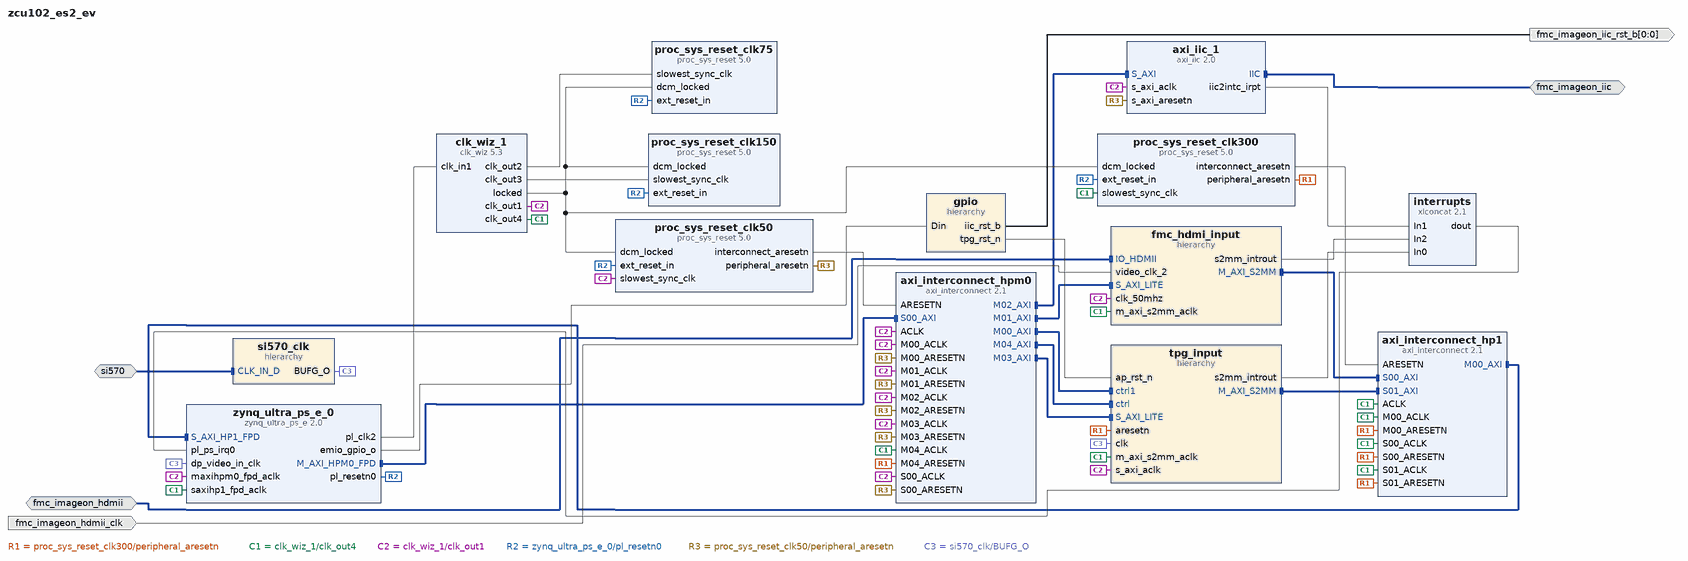
[diagram p0: block diagram of the top level]
# Vivado block design zcu102_es2_ev, xczu9eg-ffvb1156-2L-e-es2, Vivado 2016.3_sdx
create_bd_design zcu102_es2_ev

create_bd_intf_port -mode Slave -vlnv avnet.com:interface:avnet_hdmi_rtl:1.0 fmc_imageon_hdmii
create_bd_intf_port -mode Master -vlnv xilinx.com:interface:iic_rtl:1.0 fmc_imageon_iic
create_bd_intf_port -mode Slave -vlnv xilinx.com:interface:diff_clock_rtl:1.0 si570
create_bd_port -dir I -type clk fmc_imageon_hdmii_clk
set_property -dict {CONFIG.FREQ_HZ 148500000} [get_bd_ports fmc_imageon_hdmii_clk]
create_bd_port -dir O -from 0 -to 0 fmc_imageon_iic_rst_b

create_bd_cell -type ip -vlnv xilinx.com:ip:axi_iic:2.0 axi_iic_1
create_bd_cell -type ip -vlnv xilinx.com:ip:axi_interconnect:2.1 axi_interconnect_hp1
set_property -dict [list \
  CONFIG.NUM_SI 2 \
  CONFIG.NUM_MI 1 \
  CONFIG.STRATEGY 2 \
  CONFIG.ENABLE_ADVANCED_OPTIONS 0 \
  CONFIG.M00_HAS_REGSLICE 1 \
  CONFIG.M00_HAS_DATA_FIFO 2 \
  CONFIG.S00_HAS_REGSLICE 1 \
  CONFIG.S01_HAS_REGSLICE 1 \
  CONFIG.S00_HAS_DATA_FIFO 2 \
  CONFIG.S01_HAS_DATA_FIFO 2 \
  CONFIG.S02_HAS_DATA_FIFO 2 \
] [get_bd_cells axi_interconnect_hp1]
create_bd_cell -type ip -vlnv xilinx.com:ip:axi_interconnect:2.1 axi_interconnect_hpm0
set_property -dict {CONFIG.NUM_MI 5} [get_bd_cells axi_interconnect_hpm0]
create_bd_cell -type ip -vlnv xilinx.com:ip:clk_wiz:5.3 clk_wiz_1
set_property -dict [list \
  CONFIG.PRIM_IN_FREQ 300.000 \
  CONFIG.PHASESHIFT_MODE LATENCY \
  CONFIG.USE_INCLK_SWITCHOVER false \
  CONFIG.CLKIN1_JITTER_PS 33.330000000000005 \
  CONFIG.CLKOUT2_USED true \
  CONFIG.CLKOUT3_USED true \
  CONFIG.CLKOUT4_USED true \
  CONFIG.NUM_OUT_CLKS 4 \
  CONFIG.CLKOUT1_REQUESTED_OUT_FREQ 50.000 \
  CONFIG.CLKOUT2_REQUESTED_OUT_FREQ 75.000 \
  CONFIG.CLKOUT3_REQUESTED_OUT_FREQ 150.000 \
  CONFIG.CLKOUT4_REQUESTED_OUT_FREQ 300.000 \
  CONFIG.PRIM_SOURCE No_buffer \
  CONFIG.CLKOUT1_DRIVES Buffer \
  CONFIG.CLKOUT2_DRIVES Buffer \
  CONFIG.CLKOUT3_DRIVES Buffer \
  CONFIG.CLKOUT4_DRIVES Buffer \
  CONFIG.CLKOUT5_DRIVES Buffer \
  CONFIG.CLKOUT6_DRIVES Buffer \
  CONFIG.CLKOUT7_DRIVES Buffer \
  CONFIG.USE_RESET false \
  CONFIG.MMCM_DIVCLK_DIVIDE 1 \
  CONFIG.MMCM_CLKFBOUT_MULT_F 4.000 \
  CONFIG.MMCM_CLKIN1_PERIOD 3.333 \
  CONFIG.MMCM_CLKIN2_PERIOD 10.0 \
  CONFIG.MMCM_CLKOUT0_DIVIDE_F 24.000 \
  CONFIG.MMCM_CLKOUT1_DIVIDE 16 \
  CONFIG.MMCM_CLKOUT2_DIVIDE 8 \
  CONFIG.MMCM_CLKOUT3_DIVIDE 4 \
  CONFIG.CLKOUT1_JITTER 116.415 \
  CONFIG.CLKOUT1_PHASE_ERROR 77.836 \
  CONFIG.CLKOUT2_JITTER 107.379 \
  CONFIG.CLKOUT2_PHASE_ERROR 77.836 \
  CONFIG.CLKOUT3_JITTER 93.717 \
  CONFIG.CLKOUT3_PHASE_ERROR 77.836 \
  CONFIG.CLKOUT4_JITTER 81.814 \
  CONFIG.CLKOUT4_PHASE_ERROR 77.836 \
] [get_bd_cells clk_wiz_1]
create_bd_cell -type hier fmc_hdmi_input
create_bd_cell -type hier gpio
create_bd_cell -type ip -vlnv xilinx.com:ip:xlconcat:2.1 interrupts
set_property -dict {CONFIG.NUM_PORTS 3} [get_bd_cells interrupts]
create_bd_cell -type ip -vlnv xilinx.com:ip:proc_sys_reset:5.0 proc_sys_reset_clk50
set_property -dict {CONFIG.C_AUX_RESET_HIGH 0} [get_bd_cells proc_sys_reset_clk50]
create_bd_cell -type ip -vlnv xilinx.com:ip:proc_sys_reset:5.0 proc_sys_reset_clk75
set_property -dict {CONFIG.C_AUX_RESET_HIGH 0} [get_bd_cells proc_sys_reset_clk75]
create_bd_cell -type ip -vlnv xilinx.com:ip:proc_sys_reset:5.0 proc_sys_reset_clk150
set_property -dict {CONFIG.C_AUX_RESET_HIGH 0} [get_bd_cells proc_sys_reset_clk150]
create_bd_cell -type ip -vlnv xilinx.com:ip:proc_sys_reset:5.0 proc_sys_reset_clk300
set_property -dict {CONFIG.C_AUX_RESET_HIGH 0} [get_bd_cells proc_sys_reset_clk300]
create_bd_cell -type hier si570_clk
create_bd_cell -type hier tpg_input
create_bd_cell -type ip -vlnv xilinx.com:ip:zynq_ultra_ps_e:2.0 zynq_ultra_ps_e_0
set_property -dict [list \
  CONFIG.PSU__PSS_REF_CLK__FREQMHZ 33.333 \
  CONFIG.PSU__CAN1__PERIPHERAL__ENABLE 1 \
  CONFIG.PSU__CAN1__PERIPHERAL__IO {MIO 24 .. 25} \
  CONFIG.PSU__DPAUX__PERIPHERAL__ENABLE 1 \
  CONFIG.PSU__DPAUX__PERIPHERAL__IO {MIO 27 .. 30} \
  CONFIG.PSU__FPGA_PL0_ENABLE 1 \
  CONFIG.PSU__FPGA_PL1_ENABLE 1 \
  CONFIG.PSU__FPGA_PL2_ENABLE 1 \
  CONFIG.PSU__FPGA_PL3_ENABLE 1 \
  CONFIG.PSU__ENET3__PERIPHERAL__ENABLE 1 \
  CONFIG.PSU__ENET3__PERIPHERAL__IO {MIO 64 .. 75} \
  CONFIG.PSU__ENET3__GRP_MDIO__ENABLE 1 \
  CONFIG.PSU__ENET3__GRP_MDIO__IO {MIO 76 .. 77} \
  CONFIG.PSU__GPIO_EMIO__PERIPHERAL__ENABLE 1 \
  CONFIG.PSU__GPIO0_MIO__PERIPHERAL__ENABLE 1 \
  CONFIG.PSU__GPIO0_MIO__IO {MIO 0 .. 25} \
  CONFIG.PSU__GPIO1_MIO__PERIPHERAL__ENABLE 1 \
  CONFIG.PSU__GPIO1_MIO__IO {MIO 26 .. 51} \
  CONFIG.PSU__I2C0__PERIPHERAL__ENABLE 1 \
  CONFIG.PSU__I2C0__PERIPHERAL__IO {MIO 14 .. 15} \
  CONFIG.PSU__I2C1__PERIPHERAL__ENABLE 1 \
  CONFIG.PSU__I2C1__PERIPHERAL__IO {MIO 16 .. 17} \
  CONFIG.PSU__USB0__REF_CLK_SEL {Ref Clk2} \
  CONFIG.PSU__USB0__REF_CLK_FREQ 26 \
  CONFIG.PSU__DP__REF_CLK_SEL {Ref Clk3} \
  CONFIG.PSU__DP__REF_CLK_FREQ 27 \
  CONFIG.PSU__SATA__REF_CLK_SEL {Ref Clk1} \
  CONFIG.PSU__SATA__REF_CLK_FREQ 150 \
  CONFIG.PSU__DP__LANE_SEL {Dual Lower} \
  CONFIG.PSU__PMU__PERIPHERAL__ENABLE 1 \
  CONFIG.PSU__PMU__GPI0__ENABLE 1 \
  CONFIG.PSU__PMU__GPI1__ENABLE 0 \
  CONFIG.PSU__PMU__GPI2__ENABLE 0 \
  CONFIG.PSU__PMU__GPI3__ENABLE 0 \
  CONFIG.PSU__PMU__GPI4__ENABLE 0 \
  CONFIG.PSU__PMU__GPI5__ENABLE 0 \
  CONFIG.PSU__PMU__GPO0__ENABLE 1 \
  CONFIG.PSU__PMU__GPO1__ENABLE 1 \
  CONFIG.PSU__PMU__GPO2__ENABLE 1 \
  CONFIG.PSU__PMU__GPO3__ENABLE 1 \
  CONFIG.PSU__PMU__GPO4__ENABLE 1 \
  CONFIG.PSU__PMU__GPO5__ENABLE 1 \
  CONFIG.PSU__PMU__GPI0__IO {MIO 26} \
  CONFIG.PSU__PMU__GPO0__IO {MIO 32} \
  CONFIG.PSU__PMU__GPO1__IO {MIO 33} \
  CONFIG.PSU__PMU__GPO2__IO {MIO 34} \
  CONFIG.PSU__PMU__GPO3__IO {MIO 35} \
  CONFIG.PSU__PMU__GPO4__IO {MIO 36} \
  CONFIG.PSU__PMU__GPO5__IO {MIO 37} \
  CONFIG.PSU__QSPI__PERIPHERAL__ENABLE 1 \
  CONFIG.PSU__QSPI__PERIPHERAL__IO {MIO 0 .. 12} \
  CONFIG.PSU__QSPI__PERIPHERAL__MODE {Dual Parallel} \
  CONFIG.PSU__QSPI__PERIPHERAL__DATA_MODE x4 \
  CONFIG.PSU__QSPI__GRP_FBCLK__ENABLE 1 \
  CONFIG.PSU__QSPI__GRP_FBCLK__IO {MIO 6} \
  CONFIG.PSU__SD1__PERIPHERAL__ENABLE 1 \
  CONFIG.PSU__SD1__PERIPHERAL__IO {MIO 39 .. 51} \
  CONFIG.PSU__SD1__GRP_CD__ENABLE 1 \
  CONFIG.PSU__SD1__GRP_CD__IO {MIO 45} \
  CONFIG.PSU__SD1__GRP_POW__ENABLE 1 \
  CONFIG.PSU__SD1__GRP_POW__IO {MIO 43} \
  CONFIG.PSU__SD1__GRP_WP__ENABLE 1 \
  CONFIG.PSU__SD1__GRP_WP__IO {MIO 44} \
  CONFIG.PSU__SD1__SLOT_TYPE {SD 3.0} \
  CONFIG.PSU__SD1__DATA_TRANSFER_MODE 8Bit \
  CONFIG.PSU__SWDT0__PERIPHERAL__ENABLE 1 \
  CONFIG.PSU__SWDT0__PERIPHERAL__IO EMIO \
  CONFIG.PSU__TTC0__PERIPHERAL__ENABLE 1 \
  CONFIG.PSU__TTC0__PERIPHERAL__IO EMIO \
  CONFIG.PSU__DDRC__BUS_WIDTH {64 Bit} \
  CONFIG.PSU__DDRC__DEVICE_CAPACITY {4096 MBits} \
  CONFIG.PSU__DDRC__DRAM_WIDTH {8 Bits} \
  CONFIG.PSU__DDRC__ECC Disabled \
  CONFIG.PSU__DDRC__FREQ_MHZ 1066.50 \
  CONFIG.PSU__DDRC__MEMORY_TYPE {DDR 4} \
  CONFIG.PSU__DDRC__SPEED_BIN DDR4_2133P \
  CONFIG.PSU__UART0__PERIPHERAL__ENABLE 1 \
  CONFIG.PSU__UART0__PERIPHERAL__IO {MIO 18 .. 19} \
  CONFIG.PSU__UART1__PERIPHERAL__ENABLE 1 \
  CONFIG.PSU__UART1__PERIPHERAL__IO {MIO 20 .. 21} \
  CONFIG.PSU__USB0__PERIPHERAL__ENABLE 1 \
  CONFIG.PSU__USB0__PERIPHERAL__IO {MIO 52 .. 63} \
  CONFIG.PSU__USB3_0__PERIPHERAL__ENABLE 1 \
  CONFIG.PSU__USB3_0__PERIPHERAL__IO {GT Lane2} \
  CONFIG.PSU__USE__M_AXI_GP0 1 \
  CONFIG.PSU__USE__M_AXI_GP2 0 \
  CONFIG.PSU__USE__S_AXI_GP3 1 \
  CONFIG.PSU__USE__VIDEO 1 \
  CONFIG.PSU__USE__IRQ0 1 \
  CONFIG.PSU__HIGH_ADDRESS__ENABLE 1 \
  CONFIG.PSU__CRL_APB__IOPLL_CTRL__DIV2 0 \
  CONFIG.PSU__DISPLAYPORT__PERIPHERAL__ENABLE 1 \
  CONFIG.PSU__SATA__PERIPHERAL__ENABLE 1 \
  CONFIG.PSU__SATA__LANE1__IO {GT Lane3} \
  CONFIG.PSU__CRL_APB__USB3__ENABLE 1 \
  CONFIG.PSU__CRF_APB__APLL_CTRL__SRCSEL PSS_REF_CLK \
  CONFIG.PSU__CRF_APB__DPLL_CTRL__SRCSEL PSS_REF_CLK \
  CONFIG.PSU__CRF_APB__VPLL_CTRL__SRCSEL PSS_REF_CLK \
  CONFIG.PSU__CRF_APB__ACPU_CTRL__SRCSEL APLL \
  CONFIG.PSU__CRF_APB__DBG_TRACE_CTRL__SRCSEL IOPLL \
  CONFIG.PSU__CRF_APB__DBG_FPD_CTRL__SRCSEL IOPLL \
  CONFIG.PSU__CRF_APB__DP_VIDEO_REF_CTRL__SRCSEL RPLL \
  CONFIG.PSU__CRF_APB__DP_AUDIO_REF_CTRL__SRCSEL VPLL \
  CONFIG.PSU__CRF_APB__DP_STC_REF_CTRL__SRCSEL RPLL \
  CONFIG.PSU__CRF_APB__DDR_CTRL__SRCSEL DPLL \
  CONFIG.PSU__CRF_APB__GPU_REF_CTRL__SRCSEL IOPLL \
  CONFIG.PSU__CRL_APB__PL0_REF_CTRL__SRCSEL IOPLL \
  CONFIG.PSU__CRL_APB__PL1_REF_CTRL__SRCSEL IOPLL \
  CONFIG.PSU__CRF_APB__GDMA_REF_CTRL__SRCSEL APLL \
  CONFIG.PSU__CRF_APB__DPDMA_REF_CTRL__SRCSEL APLL \
  CONFIG.PSU__CRF_APB__TOPSW_MAIN_CTRL__SRCSEL VPLL \
  CONFIG.PSU__CRF_APB__TOPSW_LSBUS_CTRL__SRCSEL IOPLL \
  CONFIG.PSU__CRF_APB__DBG_TSTMP_CTRL__SRCSEL IOPLL \
  CONFIG.PSU__CRL_APB__IOPLL_CTRL__SRCSEL PSS_REF_CLK \
  CONFIG.PSU__CRL_APB__RPLL_CTRL__SRCSEL PSS_REF_CLK \
  CONFIG.PSU__CRL_APB__GEM3_REF_CTRL__SRCSEL IOPLL \
  CONFIG.PSU__CRL_APB__USB0_BUS_REF_CTRL__SRCSEL IOPLL \
  CONFIG.PSU__CRL_APB__QSPI_REF_CTRL__SRCSEL IOPLL \
  CONFIG.PSU__CRL_APB__SDIO1_REF_CTRL__SRCSEL RPLL \
  CONFIG.PSU__CRL_APB__UART0_REF_CTRL__SRCSEL IOPLL \
  CONFIG.PSU__CRL_APB__UART1_REF_CTRL__SRCSEL IOPLL \
  CONFIG.PSU__CRL_APB__I2C0_REF_CTRL__SRCSEL IOPLL \
  CONFIG.PSU__CRL_APB__I2C1_REF_CTRL__SRCSEL IOPLL \
  CONFIG.PSU__CRL_APB__CAN1_REF_CTRL__SRCSEL IOPLL \
  CONFIG.PSU__CRL_APB__CPU_R5_CTRL__SRCSEL IOPLL \
  CONFIG.PSU__CRL_APB__IOU_SWITCH_CTRL__SRCSEL IOPLL \
  CONFIG.PSU__CRL_APB__CSU_PLL_CTRL__SRCSEL RPLL \
  CONFIG.PSU__CRL_APB__PCAP_CTRL__SRCSEL RPLL \
  CONFIG.PSU__CRL_APB__LPD_LSBUS_CTRL__SRCSEL IOPLL \
  CONFIG.PSU__CRL_APB__LPD_SWITCH_CTRL__SRCSEL IOPLL \
  CONFIG.PSU__CRL_APB__DBG_LPD_CTRL__SRCSEL IOPLL \
  CONFIG.PSU__CRL_APB__ADMA_REF_CTRL__SRCSEL IOPLL \
  CONFIG.PSU__CRL_APB__TIMESTAMP_REF_CTRL__SRCSEL IOPLL \
  CONFIG.PSU__CRL_APB__USB3_DUAL_REF_CTRL__SRCSEL IOPLL \
  CONFIG.PSU__CRF_APB__VPLL_FRAC_CFG__ENABLED 1 \
  CONFIG.PSU__OVERRIDE__BASIC_CLOCK 1 \
  CONFIG.PSU__CRF_APB__DDR_CTRL__FREQMHZ 1067 \
  CONFIG.PSU__CRL_APB__PL2_REF_CTRL__FREQMHZ 300 \
] [get_bd_cells zynq_ultra_ps_e_0]
# 141 more settings of zynq_ultra_ps_e_0 are not shown: defaults, MIO pin electricals, DDR timing, and values the tool derives

# ---- hierarchy /fmc_hdmi_input ----
current_bd_instance /fmc_hdmi_input
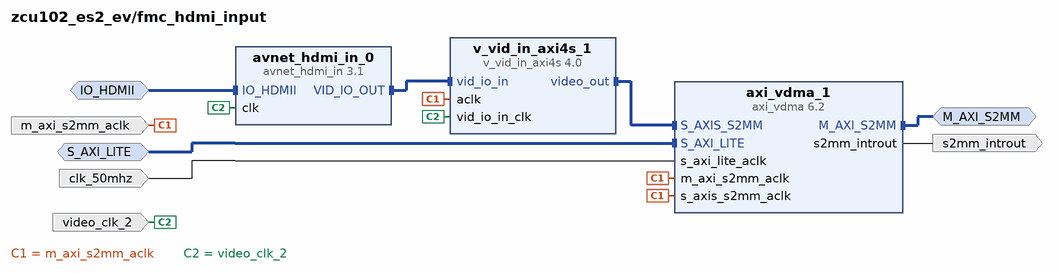
[diagram p1: block diagram inside /fmc_hdmi_input]
create_bd_intf_pin -mode Slave -vlnv avnet.com:interface:avnet_hdmi_rtl:1.0 IO_HDMII
create_bd_intf_pin -mode Master -vlnv xilinx.com:interface:aximm_rtl:1.0 M_AXI_S2MM
create_bd_intf_pin -mode Slave -vlnv xilinx.com:interface:aximm_rtl:1.0 S_AXI_LITE
create_bd_pin -dir I -type clk clk_50mhz
create_bd_pin -dir I -type clk m_axi_s2mm_aclk
create_bd_pin -dir O -type intr s2mm_introut
create_bd_pin -dir I video_clk_2

create_bd_cell -type ip -vlnv avnet:avnet_hdmi:avnet_hdmi_in:3.1 avnet_hdmi_in_0
create_bd_cell -type ip -vlnv xilinx.com:ip:axi_vdma:6.2 axi_vdma_1
set_property -dict [list \
  CONFIG.c_include_s2mm_dre 0 \
  CONFIG.c_include_s2mm_sf 0 \
  CONFIG.c_num_fstores 1 \
  CONFIG.c_s2mm_sof_enable 1 \
  CONFIG.c_s2mm_genlock_mode 2 \
  CONFIG.c_s2mm_linebuffer_depth 4096 \
  CONFIG.c_include_mm2s 0 \
  CONFIG.c_s2mm_max_burst_length 16 \
  CONFIG.c_enable_debug_info_11 1 \
  CONFIG.c_enable_debug_info_15 1 \
  CONFIG.c_addr_width 36 \
] [get_bd_cells axi_vdma_1]
create_bd_cell -type ip -vlnv xilinx.com:ip:v_vid_in_axi4s:4.0 v_vid_in_axi4s_1
set_property -dict {CONFIG.C_M_AXIS_VIDEO_FORMAT 0 CONFIG.C_HAS_ASYNC_CLK 1} [get_bd_cells v_vid_in_axi4s_1]

# ---- hierarchy /gpio ----
current_bd_instance /gpio
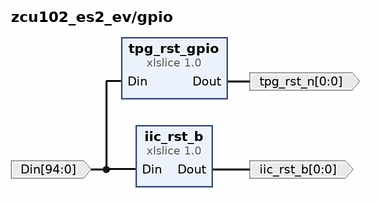
[diagram p2: block diagram inside /gpio]
create_bd_pin -dir I -from 94 -to 0 Din
create_bd_pin -dir O -from 0 -to 0 iic_rst_b
create_bd_pin -dir O -from 0 -to 0 tpg_rst_n

create_bd_cell -type ip -vlnv xilinx.com:ip:xlslice:1.0 iic_rst_b
set_property -dict {CONFIG.DIN_TO 0 CONFIG.DIN_FROM 0 CONFIG.DIN_WIDTH 95} [get_bd_cells iic_rst_b]
create_bd_cell -type ip -vlnv xilinx.com:ip:xlslice:1.0 tpg_rst_gpio
set_property -dict {CONFIG.DOUT_WIDTH 1 CONFIG.DIN_TO 1 CONFIG.DIN_FROM 1 CONFIG.DIN_WIDTH 95} [get_bd_cells tpg_rst_gpio]

# ---- hierarchy /si570_clk ----
current_bd_instance /si570_clk
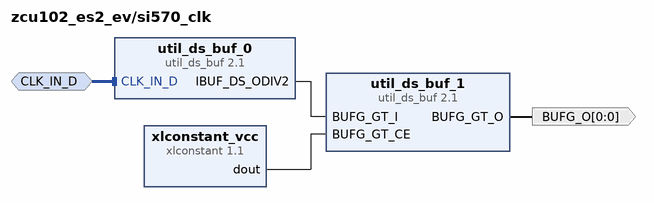
[diagram p3: block diagram inside /si570_clk]
create_bd_intf_pin -mode Slave -vlnv xilinx.com:interface:diff_clock_rtl:1.0 CLK_IN_D
create_bd_pin -dir O -from 0 -to 0 BUFG_O

create_bd_cell -type ip -vlnv xilinx.com:ip:util_ds_buf:2.1 util_ds_buf_0
set_property -dict {CONFIG.C_BUF_TYPE IBUFDSGTE} [get_bd_cells util_ds_buf_0]
create_bd_cell -type ip -vlnv xilinx.com:ip:util_ds_buf:2.1 util_ds_buf_1
set_property -dict {CONFIG.C_BUF_TYPE BUFG_GT} [get_bd_cells util_ds_buf_1]
create_bd_cell -type ip -vlnv xilinx.com:ip:xlconstant:1.1 xlconstant_vcc

# ---- hierarchy /tpg_input ----
current_bd_instance /tpg_input
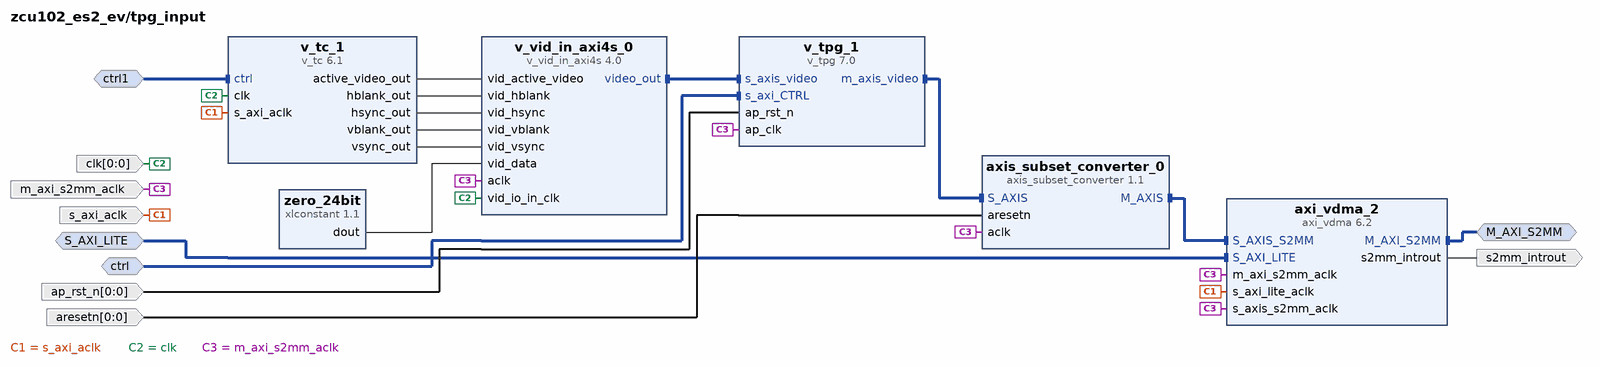
[diagram p4: block diagram inside /tpg_input]
create_bd_intf_pin -mode Master -vlnv xilinx.com:interface:aximm_rtl:1.0 M_AXI_S2MM
create_bd_intf_pin -mode Slave -vlnv xilinx.com:interface:aximm_rtl:1.0 S_AXI_LITE
create_bd_intf_pin -mode Slave -vlnv xilinx.com:interface:aximm_rtl:1.0 ctrl
create_bd_intf_pin -mode Slave -vlnv xilinx.com:interface:aximm_rtl:1.0 ctrl1
create_bd_pin -dir I -from 0 -to 0 ap_rst_n
create_bd_pin -dir I -from 0 -to 0 -type rst aresetn
create_bd_pin -dir I -from 0 -to 0 -type clk clk
create_bd_pin -dir I -type clk m_axi_s2mm_aclk
create_bd_pin -dir O -type intr s2mm_introut
create_bd_pin -dir I -type clk s_axi_aclk

create_bd_cell -type ip -vlnv xilinx.com:ip:axi_vdma:6.2 axi_vdma_2
set_property -dict [list \
  CONFIG.c_include_s2mm_dre 0 \
  CONFIG.c_include_s2mm_sf 0 \
  CONFIG.c_num_fstores 1 \
  CONFIG.c_s2mm_sof_enable 1 \
  CONFIG.c_s2mm_genlock_mode 2 \
  CONFIG.c_s2mm_linebuffer_depth 4096 \
  CONFIG.c_include_mm2s 0 \
  CONFIG.c_s2mm_max_burst_length 16 \
  CONFIG.c_enable_debug_info_11 1 \
  CONFIG.c_enable_debug_info_15 1 \
  CONFIG.c_addr_width 36 \
] [get_bd_cells axi_vdma_2]
create_bd_cell -type ip -vlnv xilinx.com:ip:axis_subset_converter:1.1 axis_subset_converter_0
set_property -dict [list \
  CONFIG.S_TDATA_NUM_BYTES 3 \
  CONFIG.M_TDATA_NUM_BYTES 2 \
  CONFIG.TDATA_REMAP {tdata[15:0]} \
] [get_bd_cells axis_subset_converter_0]
create_bd_cell -type ip -vlnv xilinx.com:ip:v_tc:6.1 v_tc_1
set_property -dict [list \
  CONFIG.max_clocks_per_line 8192 \
  CONFIG.max_lines_per_frame 8192 \
  CONFIG.VIDEO_MODE 1080p \
  CONFIG.enable_detection false \
  CONFIG.vertical_blank_generation true \
] [get_bd_cells v_tc_1]
create_bd_cell -type ip -vlnv xilinx.com:ip:v_tpg:7.0 v_tpg_1
set_property -dict {CONFIG.MAX_COLS 3840 CONFIG.MAX_ROWS 2160 CONFIG.HAS_AXI4S_SLAVE 1} [get_bd_cells v_tpg_1]
create_bd_cell -type ip -vlnv xilinx.com:ip:v_vid_in_axi4s:4.0 v_vid_in_axi4s_0
set_property -dict {CONFIG.C_M_AXIS_VIDEO_FORMAT 2 CONFIG.C_HAS_ASYNC_CLK 1 CONFIG.C_ADDR_WIDTH 5} [get_bd_cells v_vid_in_axi4s_0]
create_bd_cell -type ip -vlnv xilinx.com:ip:xlconstant:1.1 zero_24bit
set_property -dict {CONFIG.CONST_WIDTH 24 CONFIG.CONST_VAL 0} [get_bd_cells zero_24bit]

# ---- connections ----

current_bd_instance /fmc_hdmi_input
connect_bd_intf_net [get_bd_intf_pins avnet_hdmi_in_0/VID_IO_OUT] [get_bd_intf_pins v_vid_in_axi4s_1/vid_io_in]
connect_bd_intf_net [get_bd_intf_pins axi_vdma_1/S_AXIS_S2MM] [get_bd_intf_pins v_vid_in_axi4s_1/video_out]
connect_bd_intf_net [get_bd_intf_pins IO_HDMII] [get_bd_intf_pins avnet_hdmi_in_0/IO_HDMII]
connect_bd_intf_net [get_bd_intf_pins M_AXI_S2MM] [get_bd_intf_pins axi_vdma_1/M_AXI_S2MM]
connect_bd_intf_net [get_bd_intf_pins S_AXI_LITE] [get_bd_intf_pins axi_vdma_1/S_AXI_LITE]
connect_bd_net [get_bd_pins axi_vdma_1/s2mm_introut] [get_bd_pins s2mm_introut]
connect_bd_net -net clk_75mhz [get_bd_pins clk_50mhz] [get_bd_pins axi_vdma_1/s_axi_lite_aclk]
connect_bd_net [get_bd_pins m_axi_s2mm_aclk] \
  [get_bd_pins axi_vdma_1/m_axi_s2mm_aclk] [get_bd_pins axi_vdma_1/s_axis_s2mm_aclk] [get_bd_pins v_vid_in_axi4s_1/aclk]
connect_bd_net -net vtiming_mux_0_video_clk [get_bd_pins video_clk_2] [get_bd_pins avnet_hdmi_in_0/clk] [get_bd_pins v_vid_in_axi4s_1/vid_io_in_clk]

current_bd_instance /gpio
connect_bd_net [get_bd_pins tpg_rst_gpio/Dout] [get_bd_pins tpg_rst_n]
connect_bd_net -net xlslice_0_Dout [get_bd_pins iic_rst_b/Dout] [get_bd_pins iic_rst_b]
connect_bd_net -net zynq_ultra_ps_e_0_emio_gpio_o [get_bd_pins Din] [get_bd_pins iic_rst_b/Din] [get_bd_pins tpg_rst_gpio/Din]

current_bd_instance /si570_clk
connect_bd_intf_net [get_bd_intf_pins CLK_IN_D] [get_bd_intf_pins util_ds_buf_0/CLK_IN_D]
connect_bd_net [get_bd_pins util_ds_buf_0/IBUF_DS_ODIV2] [get_bd_pins util_ds_buf_1/BUFG_GT_I]
connect_bd_net [get_bd_pins util_ds_buf_1/BUFG_GT_O] [get_bd_pins BUFG_O]
connect_bd_net -net xlconstant_0_dout [get_bd_pins xlconstant_vcc/dout] [get_bd_pins util_ds_buf_1/BUFG_GT_CE]

current_bd_instance /tpg_input
connect_bd_intf_net [get_bd_intf_pins axi_vdma_2/S_AXIS_S2MM] [get_bd_intf_pins axis_subset_converter_0/M_AXIS]
connect_bd_intf_net [get_bd_intf_pins axis_subset_converter_0/S_AXIS] [get_bd_intf_pins v_tpg_1/m_axis_video]
connect_bd_intf_net [get_bd_intf_pins v_tpg_1/s_axis_video] [get_bd_intf_pins v_vid_in_axi4s_0/video_out]
connect_bd_intf_net [get_bd_intf_pins M_AXI_S2MM] [get_bd_intf_pins axi_vdma_2/M_AXI_S2MM]
connect_bd_intf_net [get_bd_intf_pins S_AXI_LITE] [get_bd_intf_pins axi_vdma_2/S_AXI_LITE]
connect_bd_intf_net -intf_net axi_interconnect_gp0_M04_AXI [get_bd_intf_pins ctrl] [get_bd_intf_pins v_tpg_1/s_axi_CTRL]
connect_bd_intf_net -intf_net axi_interconnect_gp0_M00_AXI [get_bd_intf_pins ctrl1] [get_bd_intf_pins v_tc_1/ctrl]
connect_bd_net [get_bd_pins ap_rst_n] [get_bd_pins v_tpg_1/ap_rst_n]
connect_bd_net [get_bd_pins aresetn] [get_bd_pins axis_subset_converter_0/aresetn]
connect_bd_net -net axi_vdma_3_s2mm_introut [get_bd_pins axi_vdma_2/s2mm_introut] [get_bd_pins s2mm_introut]
connect_bd_net -net clk_50mhz [get_bd_pins s_axi_aclk] [get_bd_pins axi_vdma_2/s_axi_lite_aclk] [get_bd_pins v_tc_1/s_axi_aclk]
connect_bd_net -net fmc_hdmi_input_clk_out [get_bd_pins clk] [get_bd_pins v_tc_1/clk] [get_bd_pins v_vid_in_axi4s_0/vid_io_in_clk]
connect_bd_net [get_bd_pins m_axi_s2mm_aclk] \
  [get_bd_pins axi_vdma_2/m_axi_s2mm_aclk] [get_bd_pins axi_vdma_2/s_axis_s2mm_aclk] \
  [get_bd_pins axis_subset_converter_0/aclk] [get_bd_pins v_tpg_1/ap_clk] [get_bd_pins v_vid_in_axi4s_0/aclk]
connect_bd_net [get_bd_pins v_tc_1/active_video_out] [get_bd_pins v_vid_in_axi4s_0/vid_active_video]
connect_bd_net [get_bd_pins v_tc_1/hblank_out] [get_bd_pins v_vid_in_axi4s_0/vid_hblank]
connect_bd_net [get_bd_pins v_tc_1/hsync_out] [get_bd_pins v_vid_in_axi4s_0/vid_hsync]
connect_bd_net [get_bd_pins v_tc_1/vblank_out] [get_bd_pins v_vid_in_axi4s_0/vid_vblank]
connect_bd_net [get_bd_pins v_tc_1/vsync_out] [get_bd_pins v_vid_in_axi4s_0/vid_vsync]
connect_bd_net [get_bd_pins zero_24bit/dout] [get_bd_pins v_vid_in_axi4s_0/vid_data]

current_bd_instance /
connect_bd_intf_net [get_bd_intf_pins axi_interconnect_hp1/S00_AXI] [get_bd_intf_pins fmc_hdmi_input/M_AXI_S2MM]
connect_bd_intf_net -intf_net axi_interconnect_gp0_M00_AXI [get_bd_intf_pins axi_interconnect_hpm0/M00_AXI] [get_bd_intf_pins tpg_input/ctrl1]
connect_bd_intf_net -intf_net axi_interconnect_gp0_M01_AXI [get_bd_intf_pins axi_interconnect_hpm0/M01_AXI] [get_bd_intf_pins fmc_hdmi_input/S_AXI_LITE]
connect_bd_intf_net -intf_net axi_interconnect_gp0_M02_AXI [get_bd_intf_pins axi_iic_1/S_AXI] [get_bd_intf_pins axi_interconnect_hpm0/M02_AXI]
connect_bd_intf_net -intf_net axi_interconnect_gp0_M04_AXI [get_bd_intf_pins axi_interconnect_hpm0/M04_AXI] [get_bd_intf_pins tpg_input/ctrl]
connect_bd_intf_net -intf_net axi_interconnect_hp0_M00_AXI [get_bd_intf_pins axi_interconnect_hp1/M00_AXI] [get_bd_intf_pins zynq_ultra_ps_e_0/S_AXI_HP1_FPD]
connect_bd_intf_net [get_bd_intf_pins axi_interconnect_hpm0/M03_AXI] [get_bd_intf_pins tpg_input/S_AXI_LITE]
connect_bd_intf_net [get_bd_intf_pins axi_interconnect_hp1/S01_AXI] [get_bd_intf_pins tpg_input/M_AXI_S2MM]
connect_bd_intf_net [get_bd_intf_pins axi_interconnect_hpm0/S00_AXI] [get_bd_intf_pins zynq_ultra_ps_e_0/M_AXI_HPM0_FPD]
connect_bd_intf_net [get_bd_intf_ports fmc_imageon_hdmii] [get_bd_intf_pins fmc_hdmi_input/IO_HDMII]
connect_bd_intf_net -intf_net axi_iic_0_IIC [get_bd_intf_ports fmc_imageon_iic] [get_bd_intf_pins axi_iic_1/IIC]
connect_bd_intf_net [get_bd_intf_ports si570] [get_bd_intf_pins si570_clk/CLK_IN_D]
connect_bd_net -net M06_ARESETN_1 [get_bd_pins proc_sys_reset_clk300/peripheral_aresetn] \
  [get_bd_pins axi_interconnect_hp1/M00_ARESETN] [get_bd_pins axi_interconnect_hp1/S00_ARESETN] \
  [get_bd_pins axi_interconnect_hp1/S01_ARESETN] [get_bd_pins axi_interconnect_hpm0/M04_ARESETN] \
  [get_bd_pins tpg_input/aresetn]
connect_bd_net [get_bd_pins axi_iic_1/iic2intc_irpt] [get_bd_pins interrupts/In1]
connect_bd_net -net clk_150mhz [get_bd_pins clk_wiz_1/clk_out4] \
  [get_bd_pins axi_interconnect_hp1/ACLK] [get_bd_pins axi_interconnect_hp1/M00_ACLK] \
  [get_bd_pins axi_interconnect_hp1/S00_ACLK] [get_bd_pins axi_interconnect_hp1/S01_ACLK] \
  [get_bd_pins axi_interconnect_hpm0/M04_ACLK] [get_bd_pins fmc_hdmi_input/m_axi_s2mm_aclk] \
  [get_bd_pins proc_sys_reset_clk300/slowest_sync_clk] [get_bd_pins tpg_input/m_axi_s2mm_aclk] \
  [get_bd_pins zynq_ultra_ps_e_0/saxihp1_fpd_aclk]
connect_bd_net -net clk_50mhz [get_bd_pins clk_wiz_1/clk_out1] \
  [get_bd_pins axi_iic_1/s_axi_aclk] [get_bd_pins axi_interconnect_hpm0/ACLK] [get_bd_pins axi_interconnect_hpm0/M00_ACLK] \
  [get_bd_pins axi_interconnect_hpm0/M01_ACLK] [get_bd_pins axi_interconnect_hpm0/M02_ACLK] \
  [get_bd_pins axi_interconnect_hpm0/M03_ACLK] [get_bd_pins axi_interconnect_hpm0/S00_ACLK] \
  [get_bd_pins fmc_hdmi_input/clk_50mhz] [get_bd_pins proc_sys_reset_clk50/slowest_sync_clk] \
  [get_bd_pins tpg_input/s_axi_aclk] [get_bd_pins zynq_ultra_ps_e_0/maxihpm0_fpd_aclk]
connect_bd_net [get_bd_pins clk_wiz_1/clk_out2] [get_bd_pins proc_sys_reset_clk75/slowest_sync_clk]
connect_bd_net [get_bd_pins clk_wiz_1/clk_out3] [get_bd_pins proc_sys_reset_clk150/slowest_sync_clk]
connect_bd_net [get_bd_pins clk_wiz_1/locked] \
  [get_bd_pins proc_sys_reset_clk150/dcm_locked] [get_bd_pins proc_sys_reset_clk300/dcm_locked] \
  [get_bd_pins proc_sys_reset_clk50/dcm_locked] [get_bd_pins proc_sys_reset_clk75/dcm_locked]
connect_bd_net [get_bd_pins fmc_hdmi_input/s2mm_introut] [get_bd_pins interrupts/In2]
connect_bd_net [get_bd_ports fmc_imageon_hdmii_clk] [get_bd_pins fmc_hdmi_input/video_clk_2]
connect_bd_net -net gpio_Dout [get_bd_pins zynq_ultra_ps_e_0/pl_resetn0] \
  [get_bd_pins proc_sys_reset_clk150/ext_reset_in] [get_bd_pins proc_sys_reset_clk300/ext_reset_in] \
  [get_bd_pins proc_sys_reset_clk50/ext_reset_in] [get_bd_pins proc_sys_reset_clk75/ext_reset_in]
connect_bd_net -net gpio_Dout1 [get_bd_pins gpio/tpg_rst_n] [get_bd_pins tpg_input/ap_rst_n]
connect_bd_net [get_bd_pins interrupts/dout] [get_bd_pins zynq_ultra_ps_e_0/pl_ps_irq0]
connect_bd_net -net proc_sys_reset_clk150_interconnect_aresetn [get_bd_pins proc_sys_reset_clk300/interconnect_aresetn] \
  [get_bd_pins axi_interconnect_hp1/ARESETN]
connect_bd_net [get_bd_pins proc_sys_reset_clk50/interconnect_aresetn] [get_bd_pins axi_interconnect_hpm0/ARESETN]
connect_bd_net [get_bd_pins proc_sys_reset_clk50/peripheral_aresetn] \
  [get_bd_pins axi_iic_1/s_axi_aresetn] [get_bd_pins axi_interconnect_hpm0/M00_ARESETN] \
  [get_bd_pins axi_interconnect_hpm0/M01_ARESETN] [get_bd_pins axi_interconnect_hpm0/M02_ARESETN] \
  [get_bd_pins axi_interconnect_hpm0/M03_ARESETN] [get_bd_pins axi_interconnect_hpm0/S00_ARESETN]
connect_bd_net [get_bd_pins tpg_input/s2mm_introut] [get_bd_pins interrupts/In0]
connect_bd_net -net video_clk_1 [get_bd_pins si570_clk/BUFG_O] [get_bd_pins tpg_input/clk] [get_bd_pins zynq_ultra_ps_e_0/dp_video_in_clk]
connect_bd_net -net xlslice_0_Dout [get_bd_pins gpio/iic_rst_b] [get_bd_ports fmc_imageon_iic_rst_b]
connect_bd_net [get_bd_pins zynq_ultra_ps_e_0/emio_gpio_o] [get_bd_pins gpio/Din]
connect_bd_net [get_bd_pins zynq_ultra_ps_e_0/pl_clk2] [get_bd_pins clk_wiz_1/clk_in1]

# ---- address map ----
assign_bd_address -offset 0x000000000 -range 2G -target_address_space [get_bd_addr_spaces fmc_hdmi_input/axi_vdma_1/Data_S2MM] [get_bd_addr_segs zynq_ultra_ps_e_0/SAXIGP3/HP1_DDR_LOW]
assign_bd_address -offset 0x0C0000000 -range 512M -target_address_space [get_bd_addr_spaces fmc_hdmi_input/axi_vdma_1/Data_S2MM] [get_bd_addr_segs zynq_ultra_ps_e_0/SAXIGP3/HP1_QSPI]
assign_bd_address -offset 0x0FFFC0000 -range 256K -target_address_space [get_bd_addr_spaces fmc_hdmi_input/axi_vdma_1/Data_S2MM] [get_bd_addr_segs zynq_ultra_ps_e_0/SAXIGP3/HP1_LPS_OCM]
assign_bd_address -offset 0x800000000 -range 2G -target_address_space [get_bd_addr_spaces fmc_hdmi_input/axi_vdma_1/Data_S2MM] [get_bd_addr_segs zynq_ultra_ps_e_0/SAXIGP3/HP1_DDR_HIGH]
assign_bd_address -offset 0x000000000 -range 2G -target_address_space [get_bd_addr_spaces tpg_input/axi_vdma_2/Data_S2MM] [get_bd_addr_segs zynq_ultra_ps_e_0/SAXIGP3/HP1_DDR_LOW]
assign_bd_address -offset 0x0C0000000 -range 512M -target_address_space [get_bd_addr_spaces tpg_input/axi_vdma_2/Data_S2MM] [get_bd_addr_segs zynq_ultra_ps_e_0/SAXIGP3/HP1_QSPI]
assign_bd_address -offset 0x0FFFC0000 -range 256K -target_address_space [get_bd_addr_spaces tpg_input/axi_vdma_2/Data_S2MM] [get_bd_addr_segs zynq_ultra_ps_e_0/SAXIGP3/HP1_LPS_OCM]
assign_bd_address -offset 0x800000000 -range 2G -target_address_space [get_bd_addr_spaces tpg_input/axi_vdma_2/Data_S2MM] [get_bd_addr_segs zynq_ultra_ps_e_0/SAXIGP3/HP1_DDR_HIGH]
assign_bd_address -offset 0x000A1600000 -range 64K -target_address_space [get_bd_addr_spaces zynq_ultra_ps_e_0/Data] [get_bd_addr_segs axi_iic_1/S_AXI/Reg]
assign_bd_address -offset 0x000A3000000 -range 64K -target_address_space [get_bd_addr_spaces zynq_ultra_ps_e_0/Data] [get_bd_addr_segs fmc_hdmi_input/axi_vdma_1/S_AXI_LITE/Reg]
assign_bd_address -offset 0x000A3020000 -range 64K -target_address_space [get_bd_addr_spaces zynq_ultra_ps_e_0/Data] [get_bd_addr_segs tpg_input/axi_vdma_2/S_AXI_LITE/Reg]
assign_bd_address -offset 0x000A3C20000 -range 64K -target_address_space [get_bd_addr_spaces zynq_ultra_ps_e_0/Data] [get_bd_addr_segs tpg_input/v_tc_1/ctrl/Reg]
assign_bd_address -offset 0x000A3C30000 -range 64K -target_address_space [get_bd_addr_spaces zynq_ultra_ps_e_0/Data] [get_bd_addr_segs tpg_input/v_tpg_1/s_axi_CTRL/Reg]

validate_bd_design
save_bd_design
